# Altium schematic sheet FPGA.SchDoc
size A4
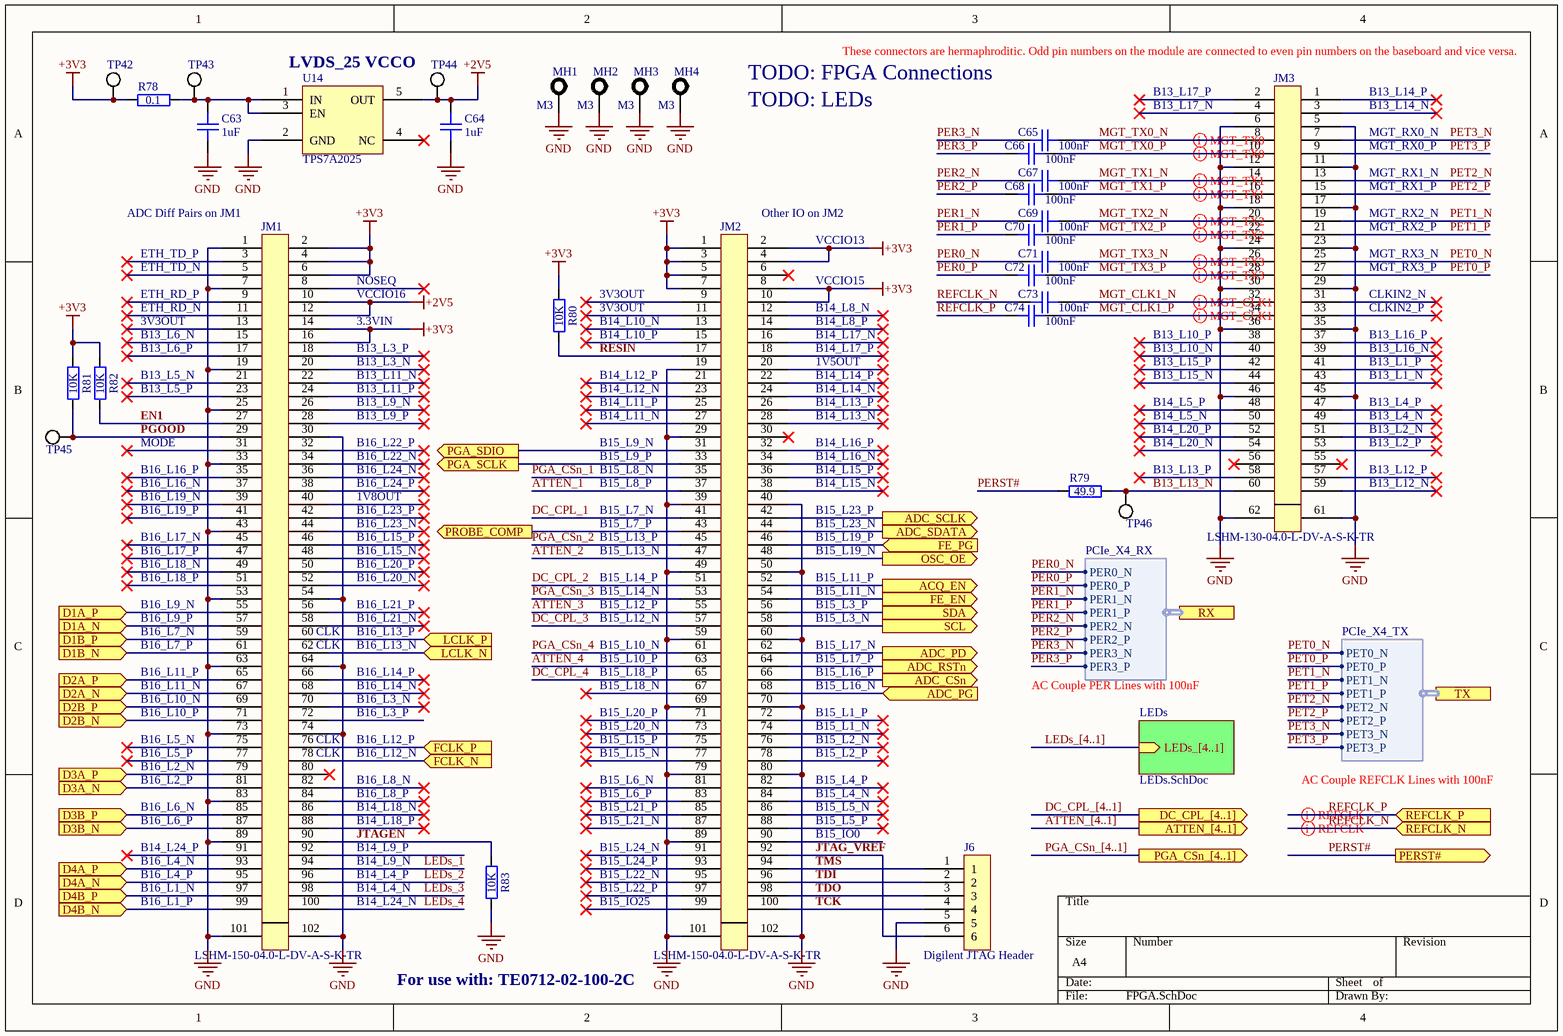
[diagram p0: FPGA.SchDoc]

## Parts
C63  1uF  [GEN_C_0402]
C64  1uF  [GEN_C_0402]
C65  100nF  [GEN_C_0402]
C66  100nF  [GEN_C_0402]
C67  100nF  [GEN_C_0402]
C68  100nF  [GEN_C_0402]
C69  100nF  [GEN_C_0402]
C70  100nF  [GEN_C_0402]
C71  100nF  [GEN_C_0402]
C72  100nF  [GEN_C_0402]
C73  100nF  [GEN_C_0402]
C74  100nF  [GEN_C_0402]
J6  2.54mm 6 Pin TH  [GEN_2.54mm_6_Pin_TH_RA]  (value not drawn)
JM1  LSHM-150-04.0-L-DV-A-S-K-TR  [SAM_LSHM-150-XX.X-XX-DV-A-S]
JM2  LSHM-150-04.0-L-DV-A-S-K-TR  [SAM_LSHM-150-XX.X-XX-DV-A-S]
JM3  LSHM-130-04.0-L-DV-A-S-K-TR  [SAM_LSHM-130-XX.X-XX-DV-A-S]
MH1  M3  [MH M3]  (no BOM)
MH2  M3  [MH M3]  (no BOM)
MH3  M3  [MH M3]  (no BOM)
MH4  M3  [MH M3]  (no BOM)
R78  0.1  [GEN_R_0402]
R79  49.9  [GEN_R_0402]
R80  10K  [GEN_R_0402]
R81  10K  [GEN_R_0402]
R82  10K  [GEN_R_0402]
R83  10K  [GEN_R_0402]
TP42  PCB  [GEN_TP_PCB]  (value not drawn)  (no BOM)
TP43  PCB  [GEN_TP_PCB]  (value not drawn)  (no BOM)
TP44  PCB  [GEN_TP_PCB]  (value not drawn)  (no BOM)
TP45  PCB  [GEN_TP_PCB]  (value not drawn)  (no BOM)
TP46  PCB  [GEN_TP_PCB]  (value not drawn)  (no BOM)
U14  TPS7A2025  [GEN_SOT23_5_950_2900X1600X1450]

## Sub-sheets
LEDs = LEDs.SchDoc: LEDs_[4..1] (in)

## Ports
ACQ_EN (out), ADC_CSn (out), ADC_PD (out), ADC_PG (in), ADC_RSTn (out), ADC_SCLK (out), ADC_SDATA (out), ATTEN_[4..1] (out), D1A_N (in), D1A_P (in), D1B_N (in), D1B_P (in), D2A_N (in), D2A_P (in), D2B_N (in), D2B_P (in), D3A_N (in), D3A_P (in), D3B_N (in), D3B_P (in), D4A_N (in), D4A_P (in), D4B_N (in), D4B_P (in), DC_CPL_[4..1] (out), FCLK_N (in), FCLK_P (in), FE_EN (out), FE_PG (in), LCLK_N (in), LCLK_P (in), OSC_OE (out), PERST# (out), PGA_CSn_[4..1] (out), PGA_SCLK (out), PGA_SDIO (out), PROBE_COMP (out), REFCLK_N (in), REFCLK_P (in), RX (harness PCIe_X4_RX), SCL (out), SDA (out), TX (harness PCIe_X4_TX)

## Harnesses
PCIe_X4_RX: PER0_N, PER0_P, PER1_N, PER1_P, PER2_N, PER2_P, PER3_N, PER3_P
PCIe_X4_TX: PET0_N, PET0_P, PET1_N, PET1_P, PET2_N, PET2_P, PET3_N, PET3_P

## Nets
+2V5: C64.2 JM1.10 JM1.12 TP44.1 U14.5(OUT)
+3V3: JM1.2 JM1.4 JM1.6 JM1.14 JM1.16 JM2.1 JM2.2 JM2.3 JM2.4 JM2.5 JM2.7 JM2.8 JM2.10 R78.1 R80.2 R81.2 R82.2 TP42.1
GND: C63.1 C64.1 J6.5 JM1.1 JM1.7 JM1.19 JM1.25 JM1.30 JM1.33 JM1.43 JM1.53 JM1.54 JM1.63 JM1.64 JM1.73 JM1.74 JM1.83 JM1.89 JM1.101 JM1.102 JM2.19 JM2.29 JM2.39 JM2.40 JM2.49 JM2.50 JM2.59 JM2.60 JM2.69 JM2.70 JM2.79 JM2.80 JM2.89 JM2.101 JM2.102 JM3.5 JM3.6 JM3.11 JM3.12 JM3.17 JM3.18 JM3.23 JM3.24 JM3.29 JM3.30 JM3.35 JM3.36 JM3.45 JM3.46 JM3.61 JM3.62 MH1.1 MH2.1 MH3.1 MH4.1 R83.1 U14.2(GND)
ACQ_EN: JM2.52 ; port ACQ_EN
ADC_CSn: JM2.66 ; port ADC_CSn
ADC_PD: JM2.62 ; port ADC_PD
ADC_PG: JM2.68 ; port ADC_PG
ADC_RSTn: JM2.64 ; port ADC_RSTn
ADC_SCLK: JM2.42 ; port ADC_SCLK
ADC_SDATA: JM2.44 ; port ADC_SDATA
ATTEN_1: JM2.37
ATTEN_2: JM2.47
ATTEN_3: JM2.55
ATTEN_4: JM2.63
B13_L13_N: JM3.60 R79.2 TP46.1
D1A_N: JM1.57 ; port D1A_N
D1A_P: JM1.55 ; port D1A_P
D1B_N: JM1.61 ; port D1B_N
D1B_P: JM1.59 ; port D1B_P
D2A_N: JM1.67 ; port D2A_N
D2A_P: JM1.65 ; port D2A_P
D2B_N: JM1.71 ; port D2B_N
D2B_P: JM1.69 ; port D2B_P
D3A_N: JM1.81 ; port D3A_N
D3A_P: JM1.79 ; port D3A_P
D3B_N: JM1.87 ; port D3B_N
D3B_P: JM1.85 ; port D3B_P
D4A_N: JM1.95 ; port D4A_N
D4A_P: JM1.93 ; port D4A_P
D4B_N: JM1.99 ; port D4B_N
D4B_P: JM1.97 ; port D4B_P
DC_CPL_1: JM2.41
DC_CPL_2: JM2.51
DC_CPL_3: JM2.57
DC_CPL_4: JM2.65
EN1: JM1.27 R82.1
FCLK_N: JM1.78 ; port FCLK_N
FCLK_P: JM1.76 ; port FCLK_P
FE_EN: JM2.54 ; port FE_EN
FE_PG: JM2.46 ; port FE_PG
JTAG_VREF: J6.6 JM2.92
JTAGEN: JM1.90 R83.2
LCLK_N: JM1.62 ; port LCLK_N
LCLK_P: JM1.60 ; port LCLK_P
LEDs_1: JM1.94
LEDs_2: JM1.96
LEDs_3: JM1.98
LEDs_4: JM1.100
MGT_CLK1_N: C73.1 JM3.32
MGT_CLK1_P: C74.1 JM3.34
MGT_TX0_N: C65.1 JM3.8
MGT_TX0_P: C66.1 JM3.10
MGT_TX1_N: C67.1 JM3.14
MGT_TX1_P: C68.1 JM3.16
MGT_TX2_N: C69.1 JM3.20
MGT_TX2_P: C70.1 JM3.22
MGT_TX3_N: C71.1 JM3.26
MGT_TX3_P: C72.1 JM3.28
OSC_OE: JM2.48 ; port OSC_OE
PER0_N: C71.2 ; port RX.PER0_N
PER0_P: C72.2 ; port RX.PER0_P
PER1_N: C69.2 ; port RX.PER1_N
PER1_P: C70.2 ; port RX.PER1_P
PER2_N: C67.2 ; port RX.PER2_N
PER2_P: C68.2 ; port RX.PER2_P
PER3_N: C65.2 ; port RX.PER3_N
PER3_P: C66.2 ; port RX.PER3_P
PERST#: R79.1 ; port PERST#
PET0_N: JM3.25 ; port TX.PET0_N
PET0_P: JM3.27 ; port TX.PET0_P
PET1_N: JM3.19 ; port TX.PET1_N
PET1_P: JM3.21 ; port TX.PET1_P
PET2_N: JM3.13 ; port TX.PET2_N
PET2_P: JM3.15 ; port TX.PET2_P
PET3_N: JM3.7 ; port TX.PET3_N
PET3_P: JM3.9 ; port TX.PET3_P
PGA_CSn_1: JM2.35
PGA_CSn_2: JM2.45
PGA_CSn_3: JM2.53
PGA_CSn_4: JM2.61
PGA_SCLK: JM2.33 ; port PGA_SCLK
PGA_SDIO: JM2.31 ; port PGA_SDIO
PGOOD: JM1.29 R81.1 TP45.1
PROBE_COMP: JM2.43 ; port PROBE_COMP
REFCLK_N: C73.2 ; port REFCLK_N
REFCLK_P: C74.2 ; port REFCLK_P
RESIN: JM2.17 R80.1
SCL: JM2.58 ; port SCL
SDA: JM2.56 ; port SDA
TCK: J6.4 JM2.100
TDI: J6.2 JM2.96
TDO: J6.3 JM2.98
TMS: J6.1 JM2.94
NetC63_2: C63.2 R78.2 TP43.1 U14.1(IN) U14.3(EN)

Not connected (* = marked no-connect by the designer): JM1 3* 5* 8* 9* 11* 13* 15* 17* 18* 20* 21* 22* 23* 24* 26* 28* 31* 32* 34* 35* 36* 37* 38* 39* 40* 41* 42* 44* 45* 46* 47* 48* 49* 50* 51* 52* 56* 58* 66* 68* 70* 72 75* 77* 80* 82* 84* 86* 88* 91* 92; JM2 6* 9* 11* 12* 13* 14* 15* 16* 18* 20* 21* 22* 23* 24* 25* 26* 27* 28* 30* 32* 34* 36* 38* 67* 71* 72* 73* 74* 75* 76* 77* 78* 81* 82* 83* 84* 85* 86* 87* 88* 90 91* 93* 95* 97* 99*; JM3 1* 2* 3* 4* 31* 33* 37* 38* 39* 40* 41* 42* 43* 44* 47* 48* 49* 50* 51* 52* 53* 54* 55* 56* 57* 58* 59*; U14 4(NC)*

## Buses and harness runs
bus ATTEN_[4..1] = port ATTEN_[4..1]
bus DC_CPL_[4..1] = port DC_CPL_[4..1]
bus LEDs_[4..1] = sheet LEDs/LEDs_[4..1]
bus PGA_CSn_[4..1] = port PGA_CSn_[4..1]

## Layout directives
differential pair: MGT_CLK1_N, MGT_CLK1_P, MGT_TX0_N, MGT_TX0_P, MGT_TX1_N, MGT_TX1_P, MGT_TX2_N, MGT_TX2_P, MGT_TX3_N, MGT_TX3_P, REFCLK_N, REFCLK_P

## Notes on the sheet
- (near U14) LVDS_25 VCCO
- TODO: FPGA Connections
- TODO: LEDs
- (near JM3) These connectors are hermaphroditic. Odd pin numbers on the module are connected to even pin numbers on the baseboard and vice versa.
- B13_L17_P
- B13_L17_N
- B13_L14_P
- B13_L14_N
- MGT_RX1_N
- MGT_RX0_N
- MGT_RX0_P
- (near JM1) ADC Diff Pairs on JM1
- (near JM2) Other IO on JM2
- VCCIO13
- MGT_RX2_N
- MGT_RX2_P
- MGT_RX1_P
- ETH_TD_P
- ETH_TD_N
- ETH_RD_P
- ETH_RD_N
- VCCIO16
- NOSEQ
- (near R80) 3V3OUT
- VCCIO15
- B14_L8_N
- MGT_RX3_N
- MGT_RX3_P
- CLKIN2_N
- CLKIN2_P
- 3V3OUT
- B13_L6_N
- (near R82) B13_L6_P
- (near R82) B13_L5_N
- 3.3VIN
- B13_L3_P
- B13_L3_N
- B13_L11_N
- (near R80) B14_L10_N
- (near R80) B14_L10_P
- B14_L12_P
- B14_L8_P
- B14_L17_N
- B14_L17_P
- 1V5OUT
- B14_L14_P
- B13_L10_P
- B13_L10_N
- B13_L15_P
- B13_L15_N
- B13_L16_P
- B13_L16_N
- B13_L1_P
- B13_L1_N
- (near R82) B13_L5_P
- MODE
- B13_L11_P
- B13_L9_N
- B13_L9_P
- B16_L22_P
- B14_L12_N
- B14_L11_P
- B14_L11_N
- B15_L9_N
- B14_L14_N
- B14_L13_P
- B14_L13_N
- B14_L16_P
- B14_L5_P
- B14_L5_N
- B14_L20_P
- B14_L20_N
- B13_L4_P
- B13_L4_N
- B13_L2_N
- B13_L2_P
- B16_L16_P
- B16_L16_N
- B16_L19_N
- B16_L19_P
- B16_L22_N
- B16_L24_N
- B16_L24_P
- 1V8OUT
- B16_L23_P
- B15_L9_P
- B15_L8_N
- B15_L8_P
- B15_L7_N
- B14_L16_N
- B14_L15_P
- B14_L15_N
- B15_L23_P
- B13_L13_P
- B13_L12_P
- B13_L12_N
- B16_L17_N
- B16_L17_P
- B16_L18_N
- B16_L18_P
- B16_L23_N
- B16_L15_P
- B16_L15_N
- B16_L20_P
- B16_L20_N
- B15_L7_P
- B15_L13_P
- B15_L13_N
- B15_L14_P
- B15_L23_N
- B15_L19_P
- B15_L19_N
- B15_L11_P
- B16_L9_N
- B16_L9_P
- B16_L7_N
- B16_L7_P
- (near JM1) CLK
- B16_L21_P
- B16_L21_N
- B16_L13_P
- B16_L13_N
- B15_L14_N
- B15_L12_P
- B15_L12_N
- B15_L10_N
- B15_L11_N
- B15_L3_P
- B15_L3_N
- B15_L17_N
- B16_L11_P
- B16_L11_N
- B16_L10_N
- B16_L10_P
- B16_L14_P
- B16_L14_N
- B16_L3_N
- B16_L3_P
- B15_L10_P
- B15_L18_P
- B15_L18_N
- B15_L20_P
- B15_L1_P
- B15_L17_P
- B15_L16_P
- B15_L16_N
- AC Couple PER Lines with 100nF
- B16_L5_N
- B16_L5_P
- B16_L2_N
- B16_L2_P
- B16_L8_N
- B16_L12_P
- B16_L12_N
- B15_L20_N
- B15_L15_P
- B15_L15_N
- B15_L6_N
- B15_L1_N
- B15_L2_N
- B15_L2_P
- B15_L4_P
- AC Couple REFCLK Lines with 100nF
- B14_L24_P
- B16_L6_N
- B16_L6_P
- B16_L8_P
- B14_L18_N
- B14_L18_P
- B14_L9_P
- B15_L6_P
- B15_L21_P
- B15_L21_N
- B15_L24_N
- B15_L4_N
- B15_L5_N
- B15_L5_P
- B15_IO0
- B16_L4_N
- B16_L4_P
- B16_L1_N
- B16_L1_P
- B14_L9_N
- B14_L4_P
- B14_L4_N
- B14_L24_N
- B15_L24_P
- B15_L22_N
- B15_L22_P
- B15_IO25
- For use with: TE0712-02-100-2C
- (near J6) Digilent JTAG Header

## Library data of the parts
C63 C64 = CAP 1uF 25V X5R 0402: Voltage Rating: 25V; Package: 0402; Supplier 1: Digi-Key; Supplier Part Number 1: 490-10017-1-ND; Value: 1uF
C65-C74 = CAP 100nF 16V X7R 0402: Voltage Rating: 16V; Package: 0402; Supplier 1: Digi-Key; Supplier Part Number 1: 490-4759-1-ND; Value: 100nF
J6 = CONN 2.54mm 6 Pin TH RA: Supplier 1: Digi-Key; Supplier Part Number 1: 732-5339-ND
JM1 JM2 = CONN LSHM-150-04.0-L-DV-A-S-K-TR: Supplier 1: Digi-Key; Supplier Part Number 1: SAM9033CT-ND
JM3 = CONN LSHM-130-04.0-L-DV-A-S-K-TR: Supplier 1: Digi-Key; Supplier Part Number 1: SAM9034CT-ND
MH1-MH4 = MH M3
R78 = RES 0.1 OHM 1% 1/6W 0402: Tolerance: 1%; Power Rating: 0.16W; Package: 0402; Supplier 1: Digi-Key; Supplier Part Number 1: P.10AKCT-ND; Value: 0.1
R79 = RES 49.9 OHM 1% 1/10W 0402: Tolerance: 1%; Power Rating: 0.1W; Package: 0402; Supplier 1: Digi-Key; Supplier Part Number 1: 311-49.9LRCT-ND; Value: 49.9
R80-R83 = RES 10K OHM 1% 1/10W 0402: Tolerance: 1%; Power Rating: 0.1W; Package: 0402; Supplier 1: Digi-Key; Supplier Part Number 1: P10.0KLCT-ND; Value: 10K
TP42-TP46 = TP PCB 1mm
U14 = IC LDO TPS7A2025: Supplier 1: Digi-Key; Supplier Part Number 1: 296-TPS7A2025PDBVRCT-ND